# Altium project FF_FINAL_PROJECT.PrjPcb (part 3 of 3)
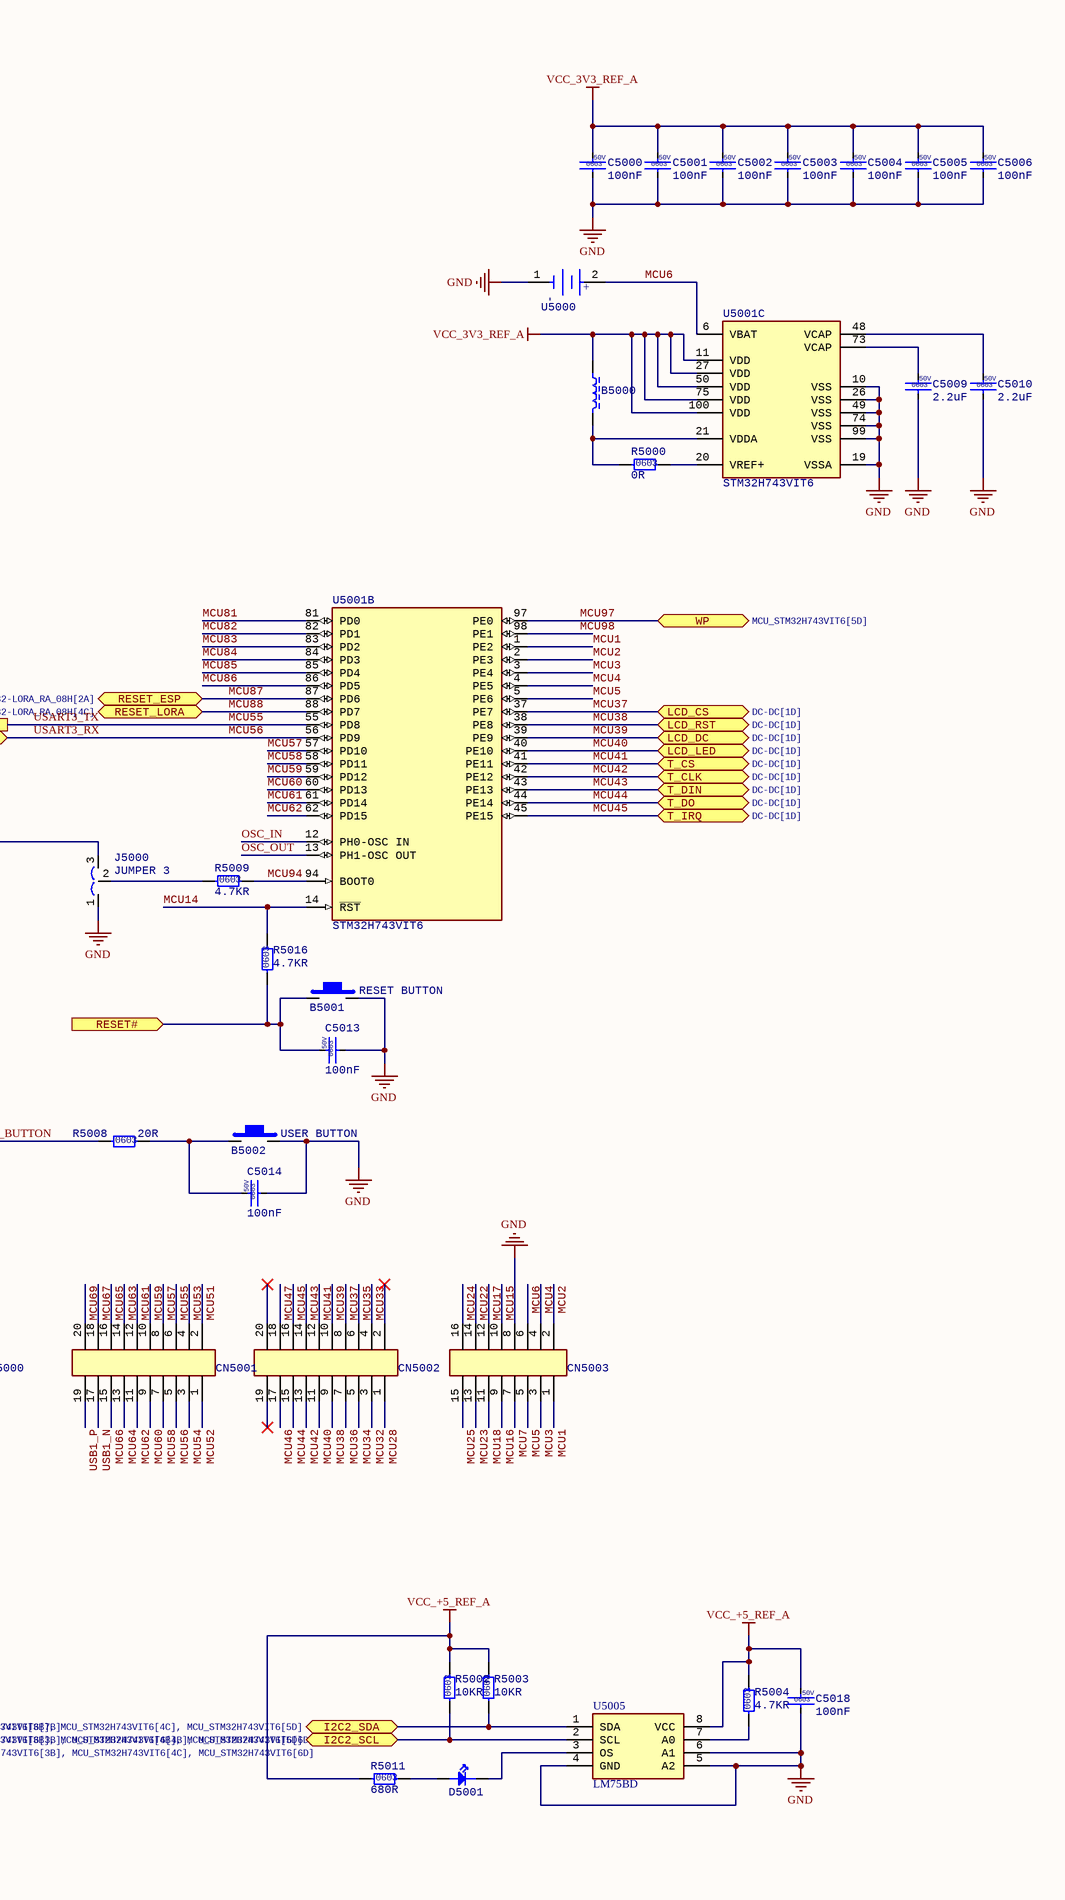
[diagram p7: MCU_STM32H743VIT6.SchDoc, right]

## Nets that join several sheets
GND: DC-DC (72 pins), TTL-RS485 (15 pins), ADC (43 pins), ESP32-LORA_RA_08H (29 pins), MCU_STM32H743VIT6 (53 pins)
VCC_3V3_LORA: DC-DC (J1001.2), TTL-RS485 (H2000.3), ESP32-LORA_RA_08H (22 pins), MCU_STM32H743VIT6 (18 pins)
VCC_+5_REF_A: DC-DC (10 pins), TTL-RS485 (H2000.1), ADC (5 pins), MCU_STM32H743VIT6 (10 pins)
VCC_+5V5_REF: DC-DC (10 pins), ADC (11 pins)
VCC_+12: DC-DC (6 pins), ADC (11 pins)
VCC_-5V5: DC-DC (C1003.1 U1000.5), ADC (C3003.1 C3009.1 U3000.4 U3002.4)
VCC_-12: DC-DC (C1009.1 U1003.5), ADC (11 pins)
CH340_CTS#: TTL-RS485 (U2002.9), ESP32-LORA_RA_08H (S4001.6 S4001.9)
CH340_RTS#: TTL-RS485 (U2002.14), ESP32-LORA_RA_08H (S4001.7 S4001.8)
CH340_RXD: TTL-RS485 (D2007.1 H2000.5 U2002.3), ESP32-LORA_RA_08H (S4000.1 S4000.3 S4001.5), MCU_STM32H743VIT6 (SB5008.1 SB5010.1)
CH340_TXD: TTL-RS485 (D2007.3 H2000.7 R2010.1), ESP32-LORA_RA_08H (S4000.2 S4000.4 S4001.4), MCU_STM32H743VIT6 (SB5009.1 SB5011.1)
CUR_IN_A+: DC-DC (D1004.1 X1002.5), ADC (5 pins)
CUR_IN_B+: DC-DC (D1005.1 X1002.7), ADC (5 pins)
D1_N: DC-DC (U1001.A7), TTL-RS485 (S2000.2), MCU_STM32H743VIT6 (R5001.1)
D1_P: DC-DC (U1001.A6), TTL-RS485 (S2000.1), MCU_STM32H743VIT6 (R5010.1)
DIGI_INPUT_1: DC-DC (D1013.1 X1002.16), MCU_STM32H743VIT6 (R5014.2)
DIGI_INPUT_2: DC-DC (D1014.1 X1002.17), MCU_STM32H743VIT6 (R5015.2)
DIGI_INPUT_3: DC-DC (D1015.1 X1002.18), MCU_STM32H743VIT6 (R5017.2)
ESP_GPIO13: ESP32-LORA_RA_08H (5 pins), MCU_STM32H743VIT6 (SB5001.1 SB5002.1)
I2C2_SCL: DC-DC (R1027.2 U1006.6), ADC (R3000.1 R3004.1 U3001.10 U3003.10), MCU_STM32H743VIT6 (6 pins)
I2C2_SDA: DC-DC (R1028.2 U1006.7), ADC (R3001.1 R3005.1 U3001.9 U3003.9), MCU_STM32H743VIT6 (6 pins)
LORA_RXD: ESP32-LORA_RA_08H (R4019.1 S4001.18 U4002.12 X4001.10), MCU_STM32H743VIT6 (SB5013.1 SB5014.1)
LORA_TXD: ESP32-LORA_RA_08H (R4020.1 S4001.16 U4002.11 X4001.12), MCU_STM32H743VIT6 (SB5012.1 SB5015.1)
MCU29: DC-DC (J1002.2 X1000.7), MCU_STM32H743VIT6 (U5001.29)
MCU30: DC-DC (X1000.9), MCU_STM32H743VIT6 (U5001.30)
MCU31: DC-DC (J1002.1 X1000.6), MCU_STM32H743VIT6 (U5001.31)
MCU37: DC-DC (X1000.3), MCU_STM32H743VIT6 (CN5002.8 U5001.37)
MCU38: DC-DC (X1000.4), MCU_STM32H743VIT6 (CN5002.9 U5001.38)
MCU39: DC-DC (X1000.5), MCU_STM32H743VIT6 (CN5002.10 U5001.39)
MCU40: DC-DC (X1000.8), MCU_STM32H743VIT6 (CN5002.11 U5001.40)
MCU41: DC-DC (X1000.11), MCU_STM32H743VIT6 (CN5002.12 U5001.41)
MCU42: DC-DC (X1000.10), MCU_STM32H743VIT6 (CN5002.13 U5001.42)
MCU43: DC-DC (X1000.12), MCU_STM32H743VIT6 (CN5002.14 U5001.43)
MCU44: DC-DC (X1000.13), MCU_STM32H743VIT6 (CN5002.15 U5001.44)
MCU45: DC-DC (X1000.14), MCU_STM32H743VIT6 (CN5002.16 U5001.45)
MCU87: ESP32-LORA_RA_08H (5 pins), MCU_STM32H743VIT6 (CN5000.10 U5001.87)
MCU88: ESP32-LORA_RA_08H (5 pins), MCU_STM32H743VIT6 (CN5000.11 U5001.88)
MCU95: ADC (U3001.2), MCU_STM32H743VIT6 (CN5000.16 U5001.95)
MCU96: ADC (U3003.2), MCU_STM32H743VIT6 (CN5000.17 U5001.96)
NetJ2000_1: TTL-RS485 (J2000.1), MCU_STM32H743VIT6 (SB5004.2 SB5006.2)
NetJ2000_3: TTL-RS485 (J2000.3), MCU_STM32H743VIT6 (SB5005.2 SB5007.2)
NetSB5000_1: ESP32-LORA_RA_08H (T4004.3), MCU_STM32H743VIT6 (SB5000.1 SB5003.1)
RS485A: DC-DC (X1002.3), TTL-RS485 (F2000.1)
RS485B: DC-DC (X1002.4), TTL-RS485 (F2001.1)
VCC_0-10_A: DC-DC (D1006.1 X1002.9), ADC (5 pins)
VCC_10-10: DC-DC (D1007.1 X1002.11), ADC (6 pins)
VOL_IN_ADC_0: DC-DC (D1018.1 X1002.12), ADC (U3003.4)
VOL_IN_ADC_1: DC-DC (D1008.1 X1002.13), ADC (U3003.5)
VOL_IN_ADC_2: DC-DC (D1009.1 X1002.14), ADC (U3003.6)
VOL_IN_ADC_3: DC-DC (D1010.1 X1002.15), ADC (U3003.7)